# EAGLE design IOExpansion (EAGLE 6.4)
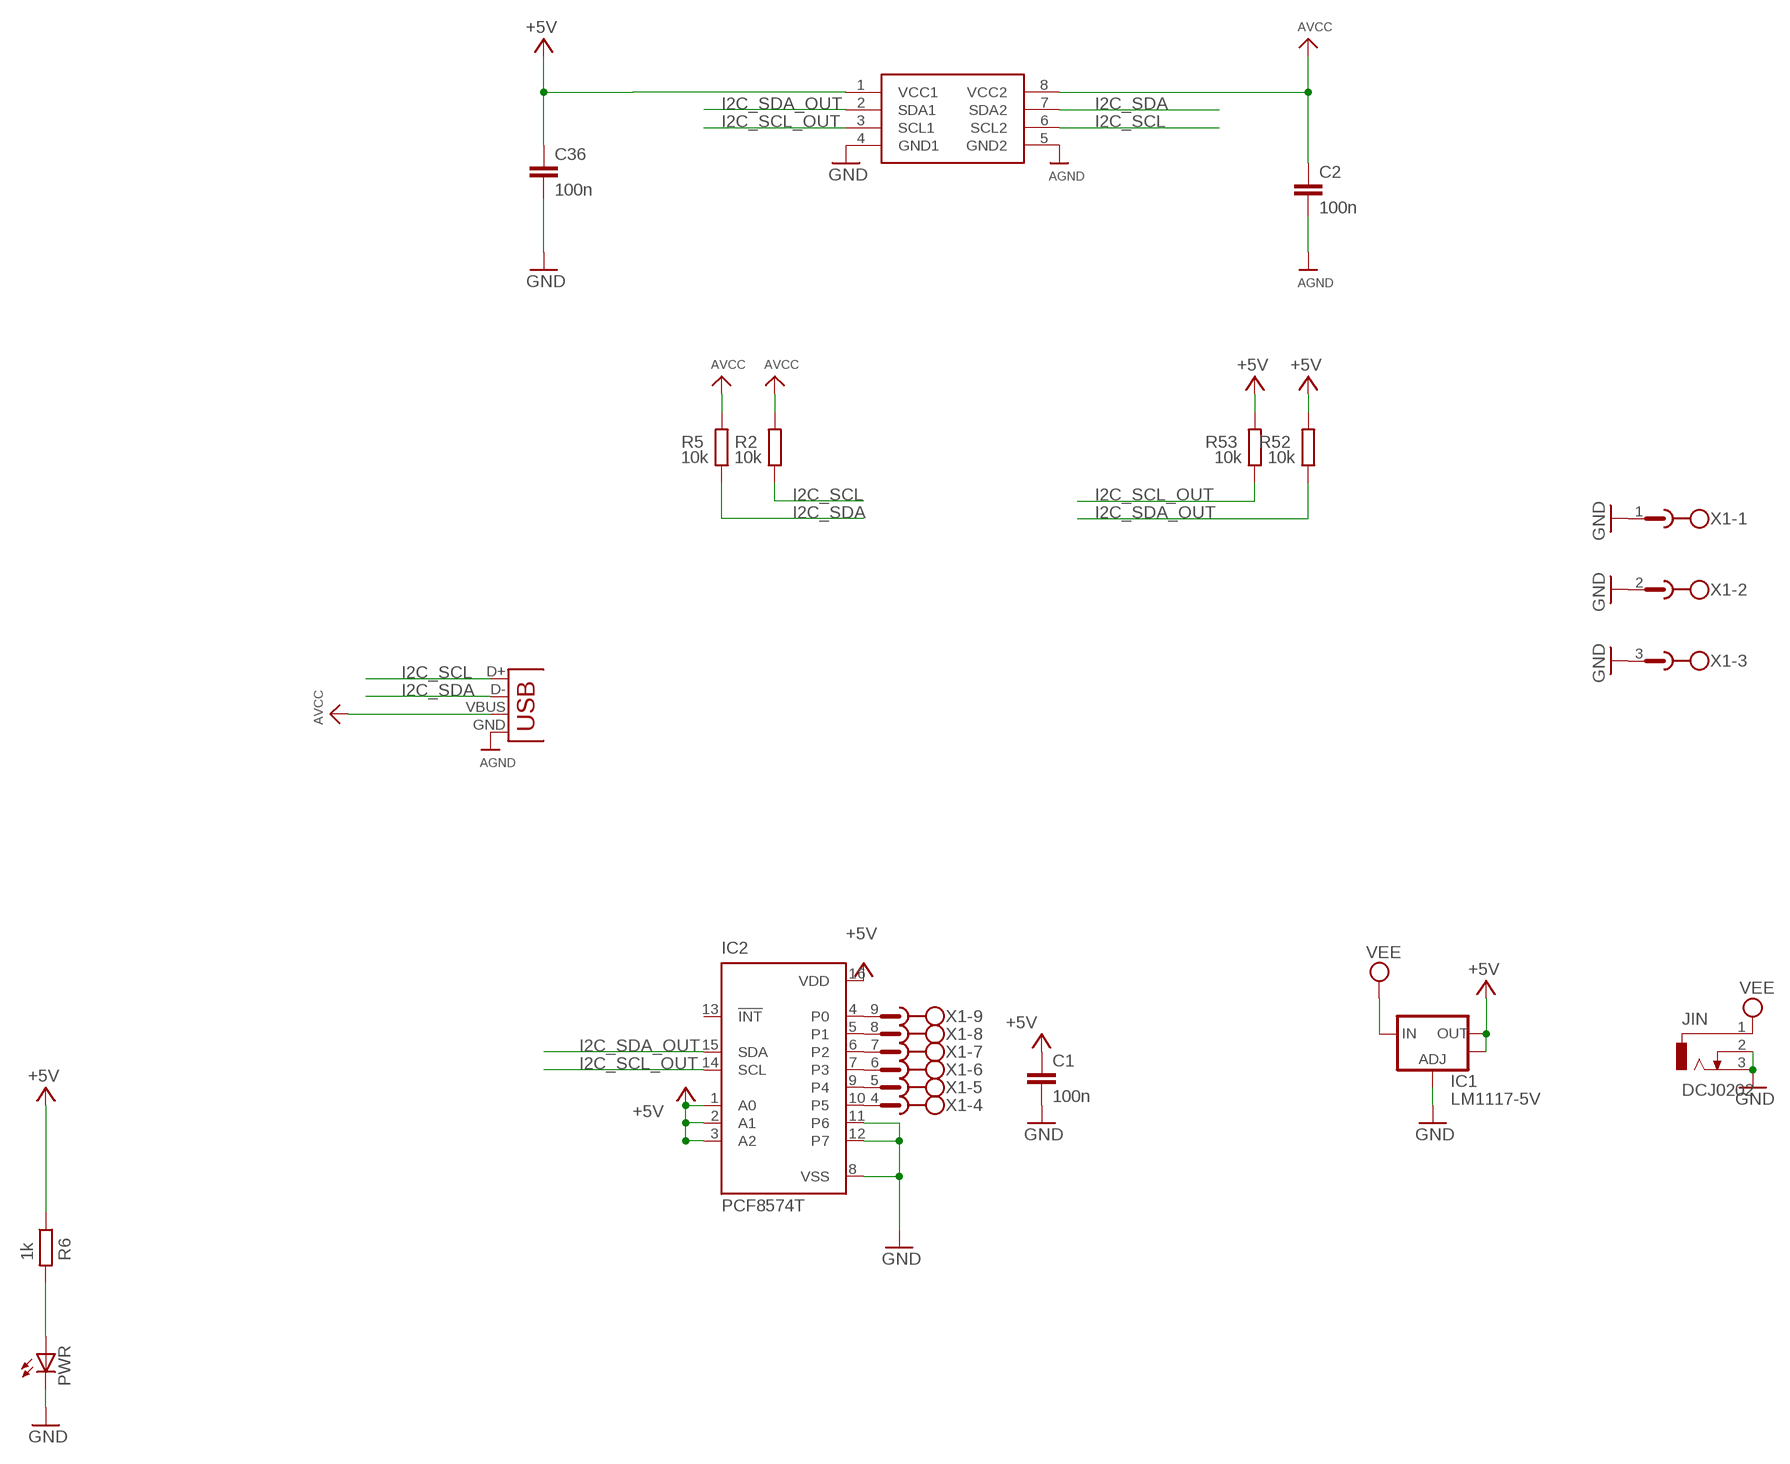
[diagram p0: schematic, sheet 1]

## Parts
C1  100n  C-EUC0805  [C0805]
C2  100n  C-EUC0805  [C0805]
C36  100n  C-EUC0805  [C0805]
IC1  LM1117-5V  V_REG_LM1117SOT223  [SOT223]
IC2  PCF8574T  [SO16W]
JIN  DCJ0202  [DCJ0202]
PWR  LED3MM  [LED3MM]
R2  10k  R-EU_R0805  [R0805]
R5  10k  R-EU_R0805  [R0805]
R6  1k  R-EU_R0805  [R0805]
R52  10k  R-EU_R0805  [R0805]
R53  10k  R-EU_R0805  [R0805]
U2  ADUM1250  [SO08]
X1  MSTBV9  [MSTBV9]
X5  USBSMD  [USB-MINIB]

## Nets
+5V: C1.1 C36.1 IC1.2(OUT) IC1.4(OUT) IC2.1(A0) IC2.2(A1) IC2.3(A2) IC2.16(VDD) R6.1 R52.2 R53.2 U2.1(VCC1)
AGND: C2.2 U2.5(GND2) X5.GND
AVCC: C2.1 R2.2 R5.2 U2.8(VCC2) X5.VBUS
GND [gnd]: C1.2 C36.2 IC1.1(ADJ) IC2.8(VSS) IC2.11(P6) IC2.12(P7) JIN.2 JIN.3 PWR.K(C) U2.4(GND1) X1.1 X1.2 X1.3
I2C_SCL: R2.1 U2.6(SCL2) X5.D+
I2C_SCL_OUT: IC2.14(SCL) R53.1 U2.3(SCL1)
I2C_SDA: R5.1 U2.7(SDA2) X5.D-
I2C_SDA_OUT: IC2.15(SDA) R52.1 U2.2(SDA1)
N$1: IC2.10(P5) X1.4
N$2: IC2.9(P4) X1.5
N$3: IC2.7(P3) X1.6
N$4: IC2.6(P2) X1.7
N$5: IC2.5(P1) X1.8
N$6: IC2.4(P0) X1.9
N$10: PWR.A R6.2
VEE: IC1.3(IN) JIN.1
Unconnected: IC2.13(!INT)

## Library data of the parts
C1 C2 C36 = rcl:C-EU: CAPACITOR, European symbol
IC1 = SparkFun:V_REG_LM1117: Voltage Regulator LM1117 Standard adjustable voltage regulator but in SMD form. Spark Fun Electronics SKU : COM-00595
IC2 = micro-philips:PCF8574: I2C-Bus Remote 8-bit I/O expander http://www.semiconductors.philips.com/acrobat_download/datasheets/PCF8574_4.pdf
JIN = con-jack:DCJ0202: DC POWER JACK Source: DCJ0202.pdf; OC_FARNELL: unknown; OC_NEWARK: unknown
PWR = led:LED: LED OSRAM: - CHIPLED LG R971, LG N971, LY N971, LG Q971, LY Q971, LO R971, LY R971 LH N974, LH R974 LS Q976, LO Q976, LY Q976 LO Q996 - Hyper CHIPLED LW Q18S LB Q993, LB Q99A, LB R99A - SideLED LS A670, LO A670, LY A670, LG A670, LP A670 LB A673, LV A673, LT A673, LW A673 LH A674 LY A675 LS A676, LA A676, LO A676, LY A676, LW A676 LS A679, LY A679, LG A679 - Hyper Micro SIDELED® LS Y876, LA Y876, LO Y876, LY Y876 LT Y87S - SmartLED LW L88C, LW L88S LB L89C, LB L89S, LG L890 LS L89K, LO L89K, LY L89K LS L896, LA L896, LO L896, LY L896 - TOPLED LS T670, LO T670, LY T670, LG T670, LP T670 LSG T670, LSP T670, LSY T670, LOP T670, LYG T670 LG T671, LOG T671, LSG T671 LB T673, LV T673, LT T673, LW T673 LH T674 LS T676, LA T676, LO T676, LY T676, LB T676, LH T676, LSB T676, LW T676 LB T67C, LV T67C, LT T67C, LS T67K, LO T67K, LY T67K, LW E67C LS E67B, LA E67B, LO E67B, LY E67B, LB E67C, LV E67C, LT E67C LW T67C LS T679, LY T679, LG T679 LS T770, LO T770, LY T770, LG T770, LP T770 LB T773, LV T773, LT T773, LW T773 LH T774 LS E675, LA E675, LY E675, LS T675 LS T776, LA T776, LO T776, LY T776, LB T776 LHGB T686 LT T68C, LB T68C - Hyper Mini TOPLED® LB M676 - Mini TOPLED Santana® LG M470 LS M47K, LO M47K, LY M47K Source: http://www.osram.convergy.de LUXEON: - LUMILED® LXK2-PW12-R00, LXK2-PW12-S00, LXK2-PW14-U00, LXK2-PW14-V00 LXK2-PM12-R00, LXK2-PM12-S00, LXK2-PM14-U00 LXK2-PE12-Q00, LXK2-PE12-R00, LXK2-PE12-S00, LXK2-PE14-T00, LXK2-PE14-U00 LXK2-PB12-K00, LXK2-PB12-L00, LXK2-PB12-M00, LXK2-PB14-N00, LXK2-PB14-P00, LXK2-PB14-Q00 LXK2-PR12-L00, LXK2-PR12-M00, LXK2-PR14-Q00, LXK2-PR14-R00 LXK2-PD12-Q00, LXK2-PD12-R00, LXK2-PD12-S00 LXK2-PH12-R00, LXK2-PH12-S00 LXK2-PL12-P00, LXK2-PL12-Q00, LXK2-PL12-R00 Source: www.luxeon.com KINGBRIGHT: KA-3528ASYC Source: www.kingbright.com
R2 R5 R6 R52 R53 = rcl:R-EU_: RESISTOR, European symbol
U2 = icoupler:ADUM1250
X1 = con-phoenix-508:MSTBV9: PHOENIX
X5 = SparkFun:USB: USB Connectors USB-B-PTH is fully proven SKU : PRT-00139 USB-miniB is fully proven SKU : PRT-00587 USB-A-PCB is untested. USB-A-H is throughly reviewed, but untested. Spark Fun Electronics SKU : PRT-00437 USB-B-SMT is throughly reviewed, but untested. Needs silkscreen touching up. USB-A-S has not been used/tested USB-MB-H has not been used/tested

## Net classes
0 default: width 0.254 mm, drill 0.254 mm, clearance 0.203 mm
1 power: width 0.305 mm, drill 0.305 mm, clearance 0.203 mm
2 gnd: width 0.305 mm, drill 0.508 mm, clearance 0.203 mm

## Board
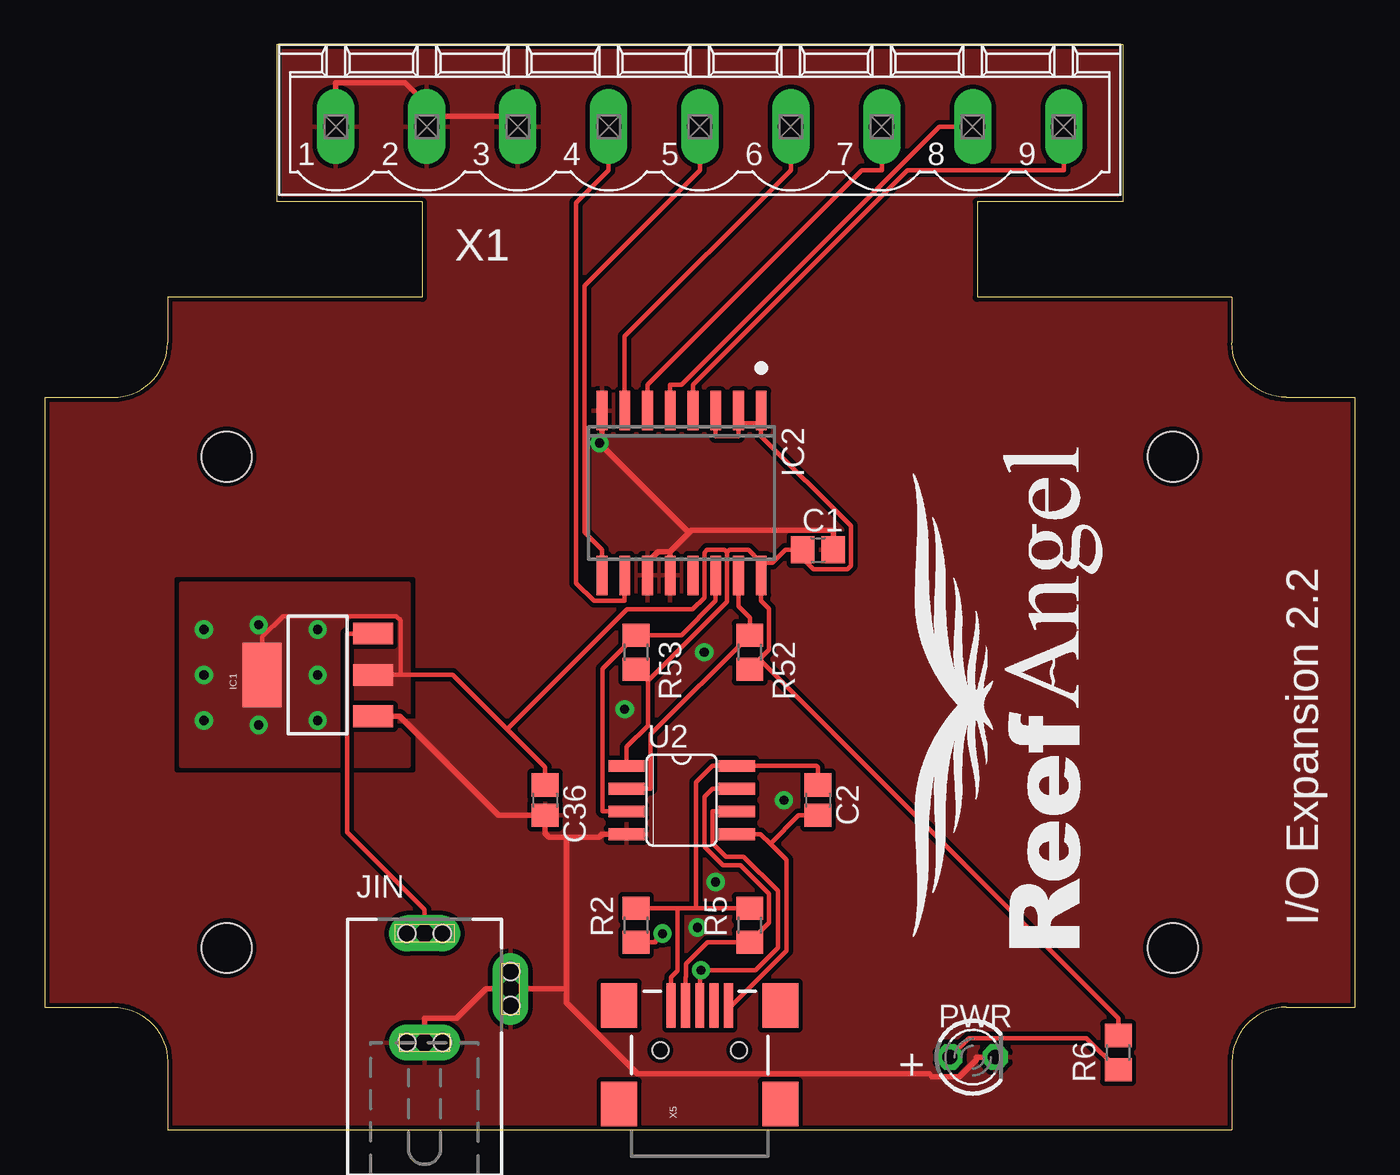
[diagram p1: board, top side]
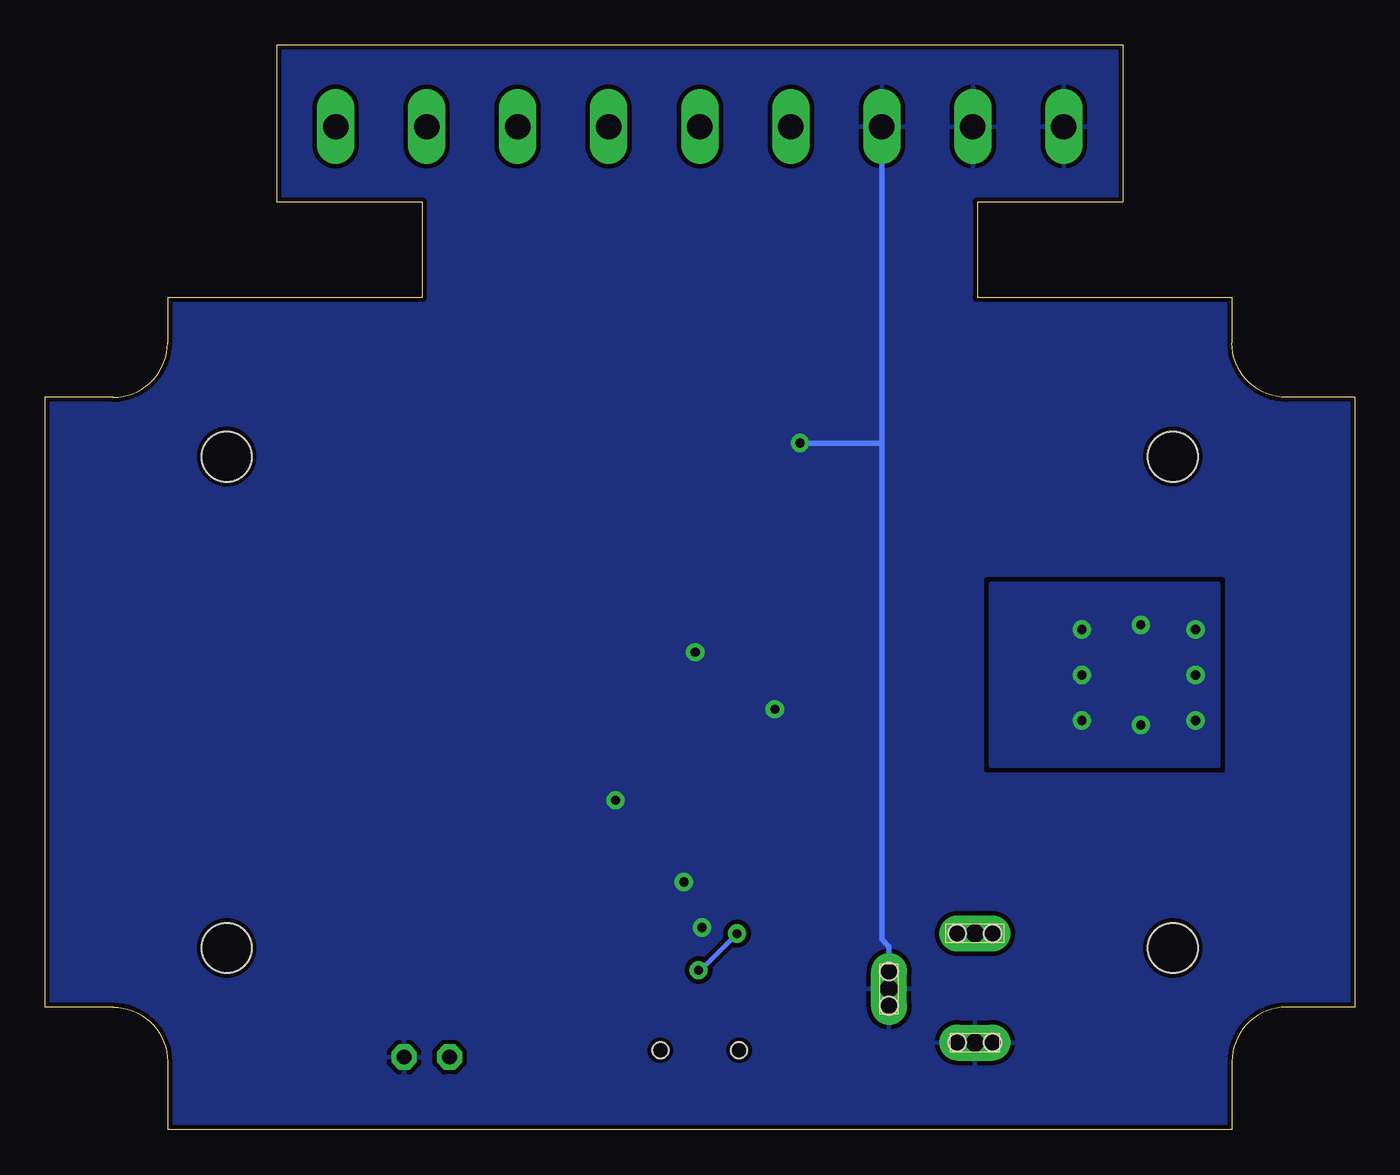
[diagram p2: board, bottom side, seen from below]

Size 73.15 x 60.58 mm. Coordinates in mm from the lower left corner, seen from the top.
Outline: 0,40.89 0,6.86 3.81,6.86 arc-90 6.86,3.81 6.86,0 66.29,0 66.29,3.81 arc-90 69.34,6.86 73.15,6.86 73.15,40.89 69.34,40.89 arc-90 66.29,43.94 66.29,46.48 52.07,46.48 52.07,51.82 60.2,51.82 60.2,60.58 12.95,60.58 12.95,51.82 21.08,51.82 21.08,46.48 6.86,46.48 6.86,43.94 arc-90 3.81,40.89 0,40.89
Copper layers (1*16): Top 0.035mm / dielectric 1.5mm / Bottom 0.035mm
Design rules "default": minimum track width 8mil, minimum drill 20mil, track to track 8mil, track to pad 8mil, pad to pad 8mil, via to via 8mil, smd to smd 8mil, copper to edge 10mil, drill to drill 8mil, minimum pad ring 12mil, minimum via ring 10mil, stop-mask expansion 4mil, vias tented up to drill 25mil, thermal gap 10mil
Holes 2.8 mm at 62.99,10.16 62.99,37.59 10.16,37.59 10.16,10.16

### Footprints (pad centres in the part's own frame; a part is rotated, then mirrored left to right if it is on the bottom)
C0805 = smd 1.3 x 1.5: 1 -0.85,0; 2 0.85,0
SOT223 = smd 1.219 x 2.235: 1 -2.311,-3.099; 2 0,-3.099; 3 2.311,-3.099 | smd 3.6 x 2.2: 4 0,3.099
SO16W = smd 0.6 x 2.2: 1 -4.445,-4.6; 2 -3.175,-4.6; 3 -1.905,-4.6; 4 -0.635,-4.6; 5 0.635,-4.6; 6 1.905,-4.6; 7 3.175,-4.6; 8 4.445,-4.6; 9 4.445,4.6; 10 3.175,4.6; 11 1.905,4.6; 12 0.635,4.6; 13 -0.635,4.6; 14 -1.905,4.6; 15 -3.175,4.6; 16 -4.445,4.6
DCJ0202 = drill 1 pad 2 long: 1 0,3.1; 2 4.8,0; 3 0,-3 | hole 1: 0.991,-2.997; -0.991,-2.997; 4.801,-0.94; 4.801,0.965; 0.991,3.099; -0.991,3.099
LED3MM = drill 0.813 octagon: A -1.27,0; K 1.27,0
R0805 = smd 1.3 x 1.5: 1 -0.95,0; 2 0.95,0
SO08 = smd 0.66 x 2.032: 1 -1.905,-3.073; 2 -0.635,-3.073; 3 0.635,-3.073; 4 1.905,-3.073; 5 1.905,3.073; 6 0.635,3.073; 7 -0.635,3.073; 8 -1.905,3.073
MSTBV9 = drill 1.397 long: 1 -20.32,0; 2 -15.24,0; 3 -10.16,0; 4 -5.08,0; 5 0,0; 6 5.08,0; 7 10.16,0; 8 15.24,0; 9 20.32,0
USB-MINIB = smd 2.5 x 0.5: D+ 2.5,0; D- 2.5,0.8; GND 2.5,-1.6; ID 2.5,-0.8; VBUS 2.5,1.6 | smd 2.5 x 2: GND@1 -3,-4.5; GND@2 -3,4.5; GND@3 2.5,4.5; GND@4 2.5,-4.5 | hole 0.9: 0,2.2; 0,-2.2

### Placement (x,y rotation side)
C1  43.18,32.38 0 top
C2  43.18,18.41 270 top
C36  27.94,18.41 270 top
IC1  15.24,25.4 90 top
IC2  35.56,35.56 180 top
JIN  21.21,7.87 0 top
PWR  51.82,4.06 0 top
R2  33.02,11.43 90 top
R5  39.37,11.43 90 top
R6  59.94,4.32 270 top
R52  39.37,26.67 270 top
R53  33.02,26.67 270 top
U2  35.56,18.41 270 top
X1  36.58,56.01 0 top
X5  36.58,4.45 90 top

### Tracks (layer width: path | path; a pad name or v marks a point on that pad's centre or on a via)
+5V  (via drill 0.51 pad 1.02)
  Top 0.254: 25.81,22.37 27.94,20.25 C36.1 | 19.86,25.4 22.79,25.4 25.81,22.37 | 38.09,32.24 37.95,32.39 36.99,32.39 36.84,32.23 36.84,29.72 36.18,29.07 32.51,29.07 25.81,22.37 | 38.09,32.24 38.09,29.49 33.67,25.07 | 40.01,31.68 39.29,32.39 38.24,32.39 38.09,32.24 | 19.86,25.4 19.67,25.4 IC1.2 | 19.86,25.4 19.86,28.45 19.62,28.69 13.3,28.69 12.14,27.53 IC1.4 | 33.67,25.07 R53.2 | 39.92,26.27 R52.2 | 39.92,26.27 40.45,26.8 40.45,29.08 40.01,29.53 IC2.16 40.01,31.32 40.01,31.68 | 39.92,26.27 59.94,6.25 R6.1 | U2.1 32.49,21.38 33.67,22.57 33.67,25.07 | 33.67,25.07 | 38.73,39.45 38.73,38.73 37.47,38.73 IC2.3 | IC2.2 38.73,39.45 | 40.01,39.45 40.01,38.73 45.01,33.72 45.01,31.5 44.82,31.3 42.92,31.3 41.84,32.38 | IC2.1 40.01,39.45 | 38.73,39.45 40.01,39.45 | 41.84,32.38 41.35,32.38 40.64,31.68 40.01,31.68 | C1.1 41.84,32.38
  other vias: 8.89,25.4 8.89,27.94 8.89,22.86 15.24,22.86 15.24,25.4 15.24,27.94 11.94,28.19 11.94,22.61
  pour Top (isolate 0.254, no thermals): 7.62,30.48 7.62,20.32 20.32,20.32 20.32,30.48
  pour Bottom (isolate 0.254, no thermals): 7.62,30.48 7.62,20.32 20.32,20.32 20.32,30.48
AGND
  Top 0.254: X5.GND 38.35,6.95 41.42,10.01 41.42,15.07 40.51,15.98 | 40.51,15.98 42.1,17.57 C2.2 | 40.51,15.98 39.98,16.51 U2.5
AVCC
  Top 0.254: 36.37,12.38 35.34,12.38 | 36.37,12.38 38.83,12.38 R5.2 | 36.37,12.38 36.37,19.41 37.29,20.32 U2.8 43.1,20.32 43.18,20.25 C2.1 | 35.34,12.38 R2.2 | 35.34,12.38 35.34,8.89 34.98,8.53 X5.VBUS
GND  (via drill 0.51 pad 1.02)
  Top 0.305: 35.98,33.34 36.13,33.49 44.03,33.49 C1.2 | 34.92,32.29 35.98,33.34 | 35.98,33.34 v30.97,38.35 31.11,38.49 IC2.8 | 34.92,32.29 34.26,32.29 33.66,31.69 IC2.11 | 29.14,16.34 28.16,16.34 27.94,16.56 C36.2 25.34,17.57 19.81,23.09 IC1.1 | 29.14,16.34 30.94,16.34 31.11,16.51 U2.4 | 29.14,7.87 29.14,16.34 | 29.14,7.87 29.14,7.1 33.1,3.13 49.4,3.13 49.55,2.98 51.07,2.98 52.02,3.93 52.02,4.06 PWR.K | 29.14,7.87 27.36,7.87 JIN.2 24.65,7.87 23.01,6.23 21.21,6.23 JIN.3 | IC2.12 34.92,32.29 | 21.34,56.59 21.34,57.23 20.11,58.46 16.26,58.46 X1.1 | X1.2 21.34,56.59 | X1.3 26.42,56.59 21.34,56.59
  Bottom 0.305: 26.42,38.35 X1.3 | 26.42,38.35 26.42,10.64 26.01,10.23 JIN.2 | 26.42,38.35 v30.97,38.35
  other vias: 32.38,23.5 36.83,26.67 41.27,18.41 37.47,13.84 36.45,11.3
  pour Bottom (isolate 0.254, rank 2): 0,0 0,60.96 73.66,60.96 73.66,0
  pour Top (isolate 0.254, rank 2): 0,0 0,60.96 73.66,60.96 73.66,0
I2C_SCL  (via drill 0.51 pad 1.02)
  Top 0.254: U2.6 37.29,17.78 37.29,16.01 38.03,15.27 39.03,15.27 40.94,13.36 40.94,10.18 39.69,8.93 v36.64,8.93 36.64,8.59 36.58,8.53 X5.D+ | v34.49,10.96 34.1,10.57 34.1,10.48 R2.1
  Bottom 0.254: v34.49,10.96 36.53,8.93 v36.64,8.93
I2C_SCL_OUT
  Top 0.254: U2.3 31.14,17.78 31.14,25.74 R53.1 35.55,27.62 37.47,29.53 IC2.14
I2C_SDA
  Top 0.254: U2.7 37.29,19.05 36.83,18.59 36.83,15.82 37.87,14.78 38.86,14.78 40.45,13.19 40.45,11.56 R5.1 37.01,10.48 35.8,9.27 35.8,8.54 35.78,8.53 X5.D-
I2C_SDA_OUT
  Top 0.254: IC2.15 38.73,29.23 39.37,28.6 R52.1 33.83,22.08 33.83,19.05 U2.2
N$1
  Top 0.254: IC2.10 32.38,29.53 30.68,29.53 29.68,30.53 29.68,51.76 31.5,53.58 X1.4
N$2
  Top 0.254: IC2.9 31.11,32.39 30.13,33.37 30.13,47.14 36.58,53.58 X1.5
N$3
  Top 0.254: X1.6 41.66,53.58 32.38,44.31 IC2.7
N$4
  Top 0.254: IC2.6 33.66,41.59 45.65,53.58 46.74,53.58 X1.7
N$5
  Top 0.254: IC2.5 34.92,41.59 35.55,41.59 49.97,56.01 X1.8
N$6
  Top 0.254: IC2.4 36.2,41.59 48.19,53.58 56.9,53.58 X1.9
N$10
  Top 0.254: PWR.A 51.62,5.13 58.18,5.13 R6.2
VEE
  Top 0.254: IC1.3 16.89,27.71 16.89,16.62 21.21,12.3 JIN.1

### Text on the board
tPlace: I/O Expansion 2.2
tNames: +